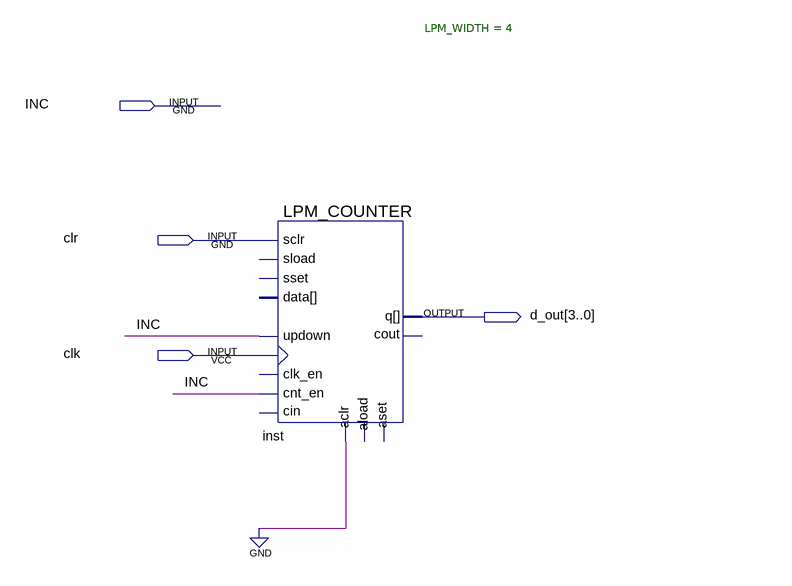
[diagram p0: schematic sheet]
// Quartus schematic counter.bdf as structural Verilog: 1 symbols, 4 pins
module counter (
  input  INC,
  input  clr,
  input  clk,
  output [3:0] d_out
);

  LPM_COUNTER #(.LPM_WIDTH(4)) inst (
    .clock(clk), .aclr(1'b0), .updown(INC), .cnt_en(INC), .sclr(clr), .q(d_out));  // open: sload, data, clk_en, aload, aset, cin, sset, cout
endmodule
